# EAGLE schematic PulsGenerator (EAGLE 9.7.0)
COMPANY: ADAFRUIT INDUSTRIES; DRAWN: KTOWN; REV: B
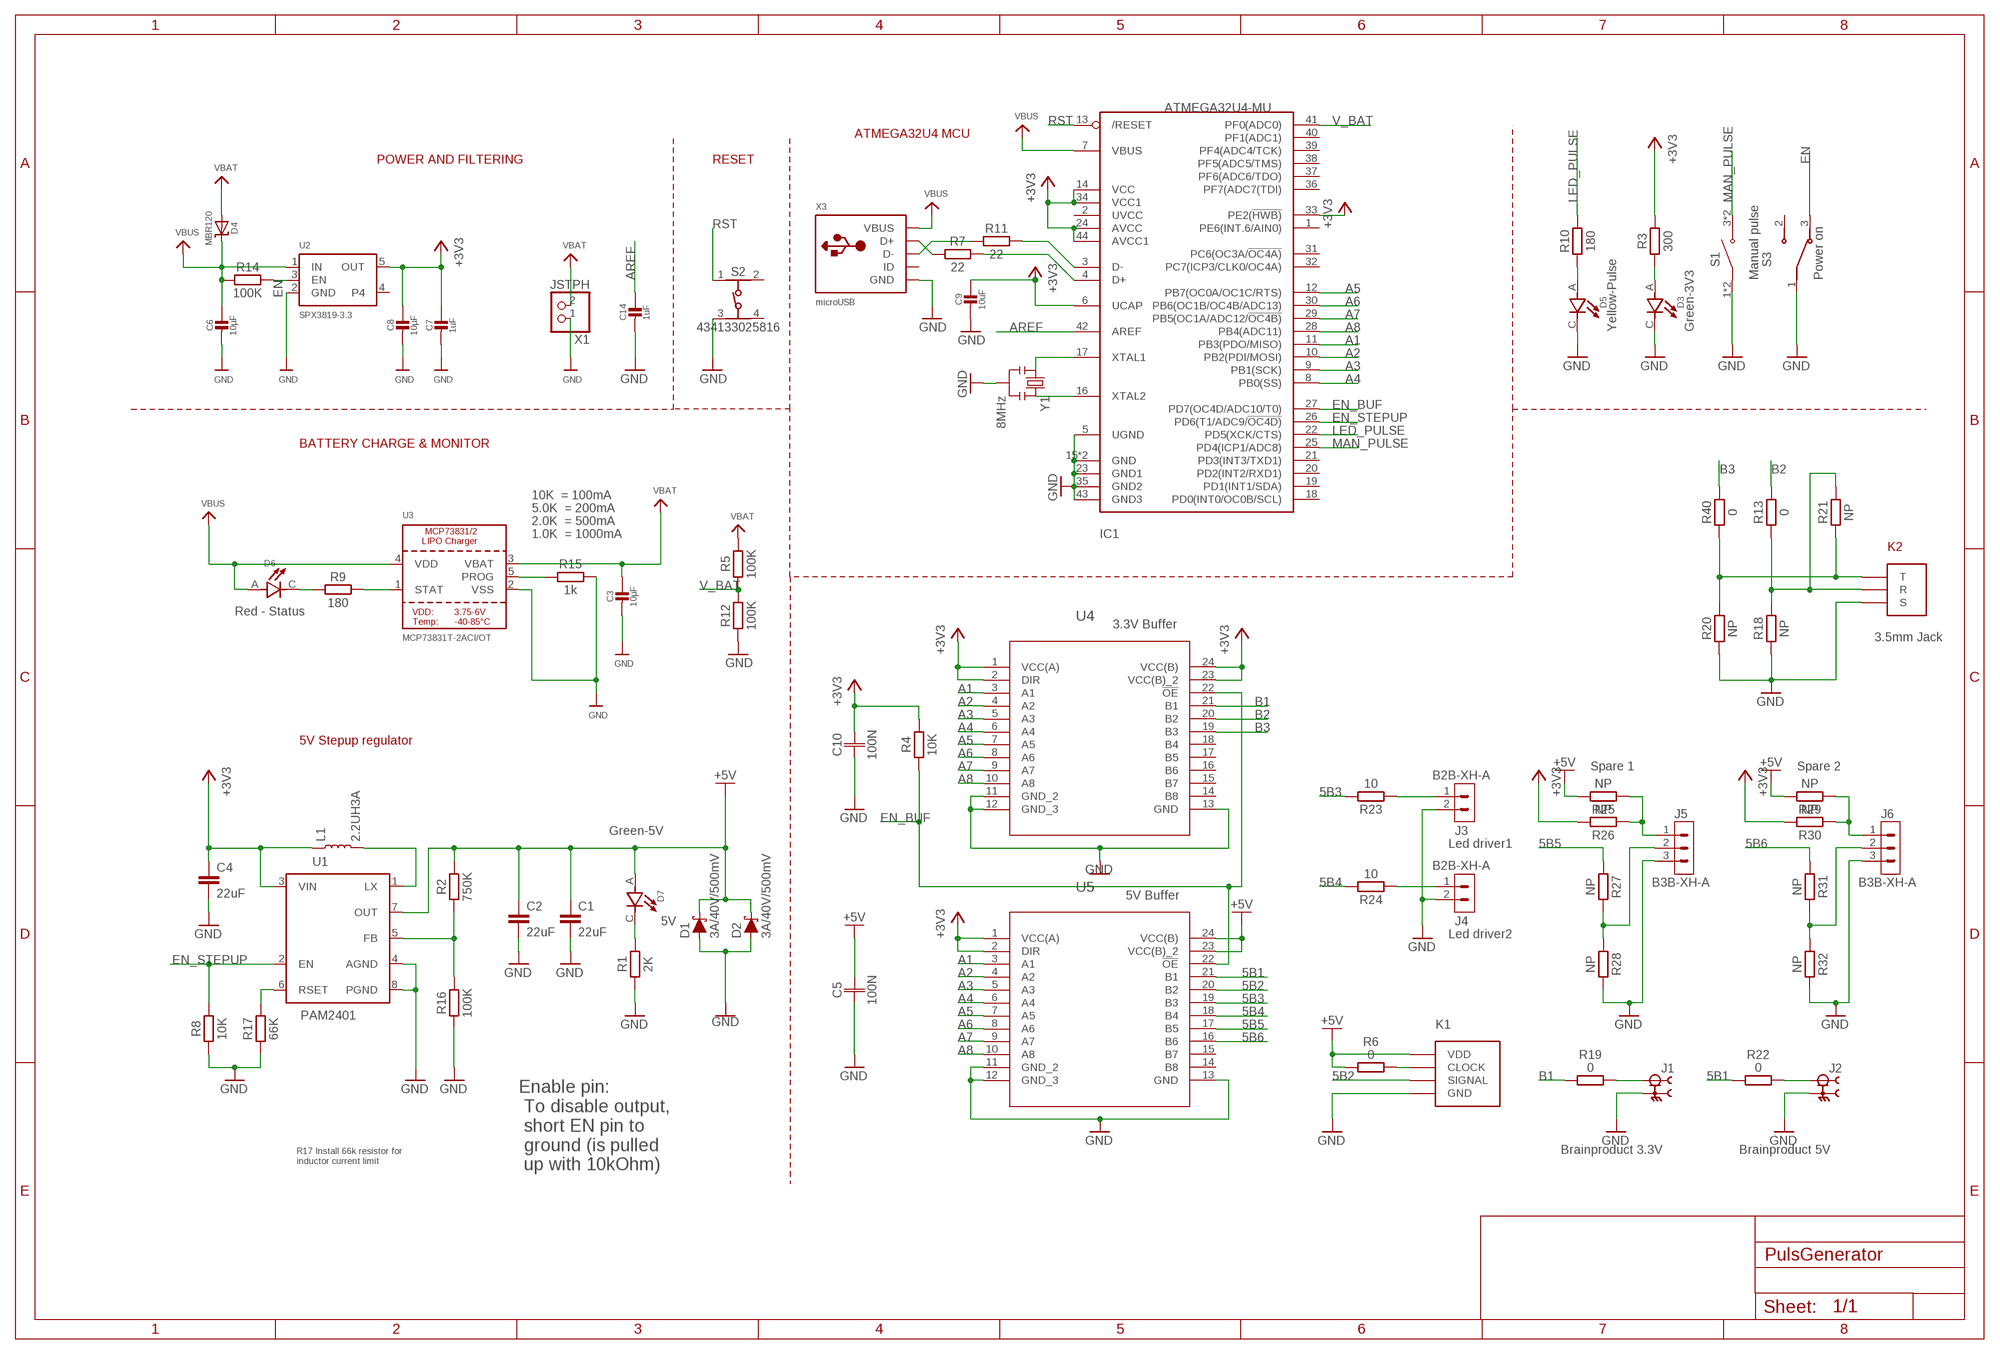
[diagram p0: schematic, sheet 1]

## Parts
C1  22uF  22UF-0805-6.3V-20%  [0805]
C2  22uF  22UF-0805-6.3V-20%  [0805]
C3  10µF  CAP_CERAMIC0805-NOOUTLINE  [0805-NO]
C4  22uF  22UF-0805-6.3V-20%  [0805]
C5  100N  C_CHIP-0603(1608-METRIC)  [CAPC1608X85]
C6  10µF  CAP_CERAMIC0805-NOOUTLINE  [0805-NO]
C7  1uF  CAP_CERAMIC0603_NO  [0603-NO]
C8  10µF  CAP_CERAMIC0805-NOOUTLINE  [0805-NO]
C9  10uF  CAP_CERAMIC0805-NOOUTLINE  [0805-NO]
C10  100N  C_CHIP-0603(1608-METRIC)  [CAPC1608X85]
C14  1uF  CAP_CERAMIC0603_NO  [0603-NO]
D1  3A/40V/500mV  DIODE-SCHOTTKY-B340A  [SMA-DIODE]
D2  3A/40V/500mV  DIODE-SCHOTTKY-B340A  [SMA-DIODE]
D3  597-6201-607F  [LED_597-6201-607F]
D4  MBR120  DIODE-SCHOTTKYSOD-123  [SOD-123]
D5  597-6201-607F  [LED_597-6201-607F]
D6  597-6201-607F  [LED_597-6201-607F]
D7  597-6201-607F  [LED_597-6201-607F]
IC1  ATMEGA32U4-MU  [TQFN44_7MM]
J1  Brainproduct 3.3V  CONBNC001  [LINX_CONBNC001]
J2  Brainproduct 5V  CONBNC001  [LINX_CONBNC001]
J3  B2B-XH-A  [B2B-XH-A]
J4  B2B-XH-A  [B2B-XH-A]
J5  B3B-XH-A  [B3B-XH-A]
J6  B3B-XH-A  [B3B-XH-A]
K1  HR10A-7R-4P  [HR10A-7R-4P]
K2  MJ-073H  [MJ-073H]
L1  2.2UH3A  INDUCTOR-IFSC1515AHER2R2M01  [INDUCTOR_4X4MM]
R1  2K  R_CHIP-0603(1608-METRIC)  [RESC1608X60]
R2  750K  R_CHIP-0603(1608-METRIC)  [RESC1608X60]
R3  300  R_CHIP-0603(1608-METRIC)  [RESC1608X60]
R4  10K  R_CHIP-0603(1608-METRIC)  [RESC1608X60]
R5  100K  R_CHIP-0603(1608-METRIC)  [RESC1608X60]
R6  0  R_CHIP-0603(1608-METRIC)  [RESC1608X60]
R7  22  R_CHIP-0603(1608-METRIC)  [RESC1608X60]
R8  10K  R_CHIP-0603(1608-METRIC)  [RESC1608X60]
R9  180  R_CHIP-0603(1608-METRIC)  [RESC1608X60]
R10  180  R_CHIP-0603(1608-METRIC)  [RESC1608X60]
R11  22  R_CHIP-0603(1608-METRIC)  [RESC1608X60]
R12  100K  R_CHIP-0603(1608-METRIC)  [RESC1608X60]
R13  0  R_CHIP-0603(1608-METRIC)  [RESC1608X60]
R14  100K  R_CHIP-0603(1608-METRIC)  [RESC1608X60]
R15  1k  R_CHIP-0603(1608-METRIC)  [RESC1608X60]
R16  100K  R_CHIP-0603(1608-METRIC)  [RESC1608X60]
R17  66K  R_CHIP-0603(1608-METRIC)  [RESC1608X60]
R18  NP  R_CHIP-0603(1608-METRIC)  [RESC1608X60]
R19  0  R_CHIP-0603(1608-METRIC)  [RESC1608X60]
R20  NP  R_CHIP-0603(1608-METRIC)  [RESC1608X60]
R21  NP  R_CHIP-0603(1608-METRIC)  [RESC1608X60]
R22  0  R_CHIP-0603(1608-METRIC)  [RESC1608X60]
R23  10  R_CHIP-0603(1608-METRIC)  [RESC1608X60]
R24  10  R_CHIP-0603(1608-METRIC)  [RESC1608X60]
R25  NP  R_CHIP-0603(1608-METRIC)  [RESC1608X60]
R26  NP  R_CHIP-0603(1608-METRIC)  [RESC1608X60]
R27  NP  R_CHIP-0603(1608-METRIC)  [RESC1608X60]
R28  NP  R_CHIP-0603(1608-METRIC)  [RESC1608X60]
R29  NP  R_CHIP-0603(1608-METRIC)  [RESC1608X60]
R30  NP  R_CHIP-0603(1608-METRIC)  [RESC1608X60]
R31  NP  R_CHIP-0603(1608-METRIC)  [RESC1608X60]
R32  NP  R_CHIP-0603(1608-METRIC)  [RESC1608X60]
R40  0  R_CHIP-0603(1608-METRIC)  [RESC1608X60]
S1  B3F-1022  [SW_B3F-1022]
S2  434133025816  [434133025816]
S3  MSS-102568-14A-90-D  [SW_MSS-102568-14A-90-D]
U1  PAM2401  [MSOP8]
U2  SPX3819-3.3  VREG_SOT23-5  [SOT23-5]
U3  MCP73831T-2ACI/OT  MCP73831/2  [SOT23-5]
U4  74LVCH8T245PW-Q10JTSSOP24_SOT355-1_NEX  [TSSOP24_SOT355-1_NEX]
U5  74LVCH8T245PW-Q10JTSSOP24_SOT355-1_NEX  [TSSOP24_SOT355-1_NEX]
X1  JSTPH  CON_JST_PH_2PIN  [JSTPH2]
X3  microUSB  USB_MICRO_20329_V2  [4UCONN_20329_V2]
Y1  8MHz  RESONATORSMD  [RESONATOR-SMD]

## Nets
5B1: R22.2 U5.21(B1)
5B2: K1.P$4(SIGNAL) U5.20(B2)
5B3: R23.2 U5.19(B3)
5B4: R24.2 U5.18(B4)
5B5: R27.1 U5.17(B5)
5B6: R31.1 U5.16(B6)
+3V3 [Vcc3V3]: C4.1 C7.1 C8.1 C9.1 C10.2 IC1.6(UCAP) IC1.14(VCC) IC1.24(AVCC) IC1.33(PE2(!HWB)) IC1.34(VCC1) IC1.44(AVCC1) L1.P$1 R3.2 R4.2 R26.2 R30.2 U1.3(VIN) U2.5(OUT) U4.1(VCC(A)) U4.2(DIR) U4.23(VCC(B)_2) U4.24(VCC(B)) U5.1(VCC(A)) U5.2(DIR)
+5V: C1.1 C2.1 C5.2 D1.C D2.C D7.A K1.P$1(VDD) R2.2 R6.2 R25.2 R29.2 U1.7(OUT) U5.23(VCC(B)_2) U5.24(VCC(B))
A1: IC1.11(PB3(PDO/MISO)) U4.3(A1) U5.3(A1)
A2: IC1.10(PB2(PDI/MOSI)) U4.4(A2) U5.4(A2)
A3: IC1.9(PB1(SCK)) U4.5(A3) U5.5(A3)
A4: IC1.8(PB0(SS)) U4.6(A4) U5.6(A4)
A5: IC1.12(PB7(OC0A/OC1C/RTS)) U4.7(A5) U5.7(A5)
A6: IC1.30(PB6(OC1B/OC4B/ADC13)) U4.8(A6) U5.8(A6)
A7: IC1.29(PB5(OC1A/ADC12/!OC4B)) U4.9(A7) U5.9(A7)
A8: IC1.28(PB4(ADC11)) U4.10(A8) U5.10(A8)
AREF: C14.1 IC1.42(AREF)
B1: R19.2 U4.21(B1)
B2: R13.2 U4.20(B2)
B3: R40.2 U4.19(B3)
D+: IC1.4(D+) R7.2
D-: IC1.3(D-) R11.2
EN: R14.2 S3.3 U2.3(EN)
EN_BUF: IC1.27(PD7(OC4D/ADC10/T0)) R4.1 U4.22(!OE) U5.22(!OE)
EN_STEPUP: IC1.26(PD6(T1/ADC9/!OC4D)) R8.2 U1.2(EN)
GND: C1.2 C2.2 C3.2 C4.2 C5.1 C6.2 C7.2 C8.2 C9.2 C10.1 C14.2 D1.A D2.A D3.C D5.C IC1.5(UGND) IC1.15(GND) IC1.23(GND1) IC1.35(GND2) IC1.43(GND3) IC1.THERMAL(GND) J1.S1 J1.S2 J1.S3 J1.S4 J2.S1 J2.S2 J2.S3 J2.S4 J3.2 J4.2 J5.3 J6.3 K1.P$2(GND) K2.P$2(S) R1.1 R8.1 R12.1 R15.2 R16.1 R17.1 R18.1 R20.1 R28.2 R32.2 S1.1(COM) S1.2(COM) S2.3 S3.1 U1.4(AGND) U1.8(PGND) U2.2(GND) U3.2(VSS) U4.11(GND_2) U4.12(GND_3) U4.13(GND) U5.11(GND_2) U5.12(GND_3) U5.13(GND) X1.1 X3.BASE@1(GND) X3.BASE@2(GND) X3.GND X3.SPRT@1(GND) X3.SPRT@2(GND) X3.SPRT@3(GND) X3.SPRT@4(GND) Y1.2
LED_PULSE: IC1.22(PD5(XCK/CTS)) R10.2
MAN_PULSE: IC1.25(PD4(ICP1/ADC8)) S1.3(NO) S1.4(NO)
N$1: D6.C R9.1
N$2: D5.A R10.1
N$3: R9.2 U3.1(STAT)
N$4: R15.1 U3.5(PROG)
N$5: D3.A R3.1
N$7: J1.1 R19.1
N$8: K1.P$3(CLOCK) R6.1
N$9: K2.P$3(T) R20.2 R21.1 R40.1
N$10: K2.P$1(R) R13.1 R18.2 R21.2
N$11: IC1.16(XTAL2) Y1.3
N$12: IC1.17(XTAL1) Y1.1
N$14: J2.1 R22.1
N$15: R7.1 X3.D+
N$16: R11.1 X3.D-
N$17: J3.1 R23.1
N$18: J4.1 R24.1
N$19: J5.1 R25.1 R26.1
N$20: J6.1 R29.1 R30.1
N$21: J5.2 R27.2 R28.1
N$22: J6.2 R31.2 R32.1
N$49: R2.1 R16.2 U1.5(FB)
N$50: L1.P$2 U1.1(LX)
N$51: R17.2 U1.6(RSET)
N$52: D7.C R1.2
RST: IC1.13(/RESET) S2.1
V_BAT: IC1.41(PF0(ADC0)) R5.1 R12.2
VBAT [Vbat]: C3.1 D4.A R5.2 U3.3(VBAT) X1.2
VBUS [Vbus]: C6.1 D4.C D6.A IC1.7(VBUS) R14.1 U2.1(IN) U3.4(VDD) X3.VBUS
Unconnected: IC1.1(PE6(INT.6/AIN0)) IC1.2(UVCC) IC1.18(PD0(INT0/OC0B/SCL)) IC1.19(PD1(INT1/SDA)) IC1.20(PD2(INT2/RXD1)) IC1.21(PD3(INT3/TXD1)) IC1.31(PC6(OC3A/!OC4A)) IC1.32(PC7(ICP3/CLK0/OC4A)) IC1.36(PF7(ADC7(TDI)) IC1.37(PF6(ADC6/TDO)) IC1.38(PF5(ADC5/TMS)) IC1.39(PF4(ADC4/TCK)) IC1.40(PF1(ADC1)) S2.2 S2.4 S3.2 U2.4 U4.14(B8) U4.15(B7) U4.16(B6) U4.17(B5) U4.18(B4) U5.14(B8) U5.15(B7) X3.ID

## Notes on the sheet
- ATMEGA32U4 MCU
- POWER AND FILTERING | RESET
- Manual pulse | Power on
- Yellow-Pulse | Green-3V3
- BATTERY CHARGE & MONITOR
- 10K  = 100mA
- 5.0K  = 200mA
- 2.0K  = 500mA
- 1.0K  = 1000mA
- Red - Status
- 3.3V Buffer
- 3.5mm Jack
- 5V Stepup regulator
- Spare 1 | Spare 2
- Green-5V
- Led driver1
- 5V Buffer
- 5V
- Led driver2
- Enable pin:
   To disable output,
   short EN pin to
   ground (is pulled
   up with 10kOhm)
- R17 Install 66k resistor for
  inductor current limit

## Library data of the parts
C1 C2 C4 = SparkFun-Capacitors:22UF: 22µF ceramic capacitors A capacitor is a passive two-terminal electrical component used to store electrical energy temporarily in an electric field.; FARNELL: 1867956
C3 C9 C14 = PulsGenerator v26:CAP_CERAMIC: Ceramic Capacitors For new designs, use the packages preceded by an '_' character since they are more reliable: The following footprints should be used on most boards: _0402 - Standard footprint for regular board layouts _0603 - Standard footprint for regular board layouts _0805 - Standard footprint for regular board layouts _1206 - Standard footprint for regular board layouts For extremely tight-pitch boards where space is at a premium, the following 'micro-pitch' footprints can be used (smaller pads, no silkscreen outline, etc.): _0402MP - Micro-pitch footprint for very dense/compact boards _0603MP - Micro-pitch footprint for very dense/compact boards _0805MP - Micro-pitch footprint for very dense/compact boards _1206MP - Micro-pitch footprint for very dense/compact boards
C5 C10 = Capacitor:C: Capacitor - Generic
C6 C8 = PulsGenerator v26:CAP_CERAMIC: Ceramic Capacitors For new designs, use the packages preceded by an '_' character since they are more reliable: The following footprints should be used on most boards: _0402 - Standard footprint for regular board layouts _0603 - Standard footprint for regular board layouts _0805 - Standard footprint for regular board layouts _1206 - Standard footprint for regular board layouts For extremely tight-pitch boards where space is at a premium, the following 'micro-pitch' footprints can be used (smaller pads, no silkscreen outline, etc.): _0402MP - Micro-pitch footprint for very dense/compact boards _0603MP - Micro-pitch footprint for very dense/compact boards _0805MP - Micro-pitch footprint for very dense/compact boards _1206MP - Micro-pitch footprint for very dense/compact boards; FARNELL: 3924598
C7 = PulsGenerator v26:CAP_CERAMIC: Ceramic Capacitors For new designs, use the packages preceded by an '_' character since they are more reliable: The following footprints should be used on most boards: _0402 - Standard footprint for regular board layouts _0603 - Standard footprint for regular board layouts _0805 - Standard footprint for regular board layouts _1206 - Standard footprint for regular board layouts For extremely tight-pitch boards where space is at a premium, the following 'micro-pitch' footprints can be used (smaller pads, no silkscreen outline, etc.): _0402MP - Micro-pitch footprint for very dense/compact boards _0603MP - Micro-pitch footprint for very dense/compact boards _0805MP - Micro-pitch footprint for very dense/compact boards _1206MP - Micro-pitch footprint for very dense/compact boards; FARNELL: 2464627
D1 D2 = SparkFun-DiscreteSemi:DIODE-SCHOTTKY: Schottky diode A Schottky diode is a semiconductor diode which has a low forward voltage drop and a very fast switching action.; FARNELL: 1843668
D3 D7 = ESP32-S3-WROOM-1-N16R8:597-6201-607F; FARNELL: 3548407
D4 = PulsGenerator v26:DIODE-SCHOTTKY; FARNELL: 2533227
D5 = ESP32-S3-WROOM-1-N16R8:597-6201-607F; FARNELL: 3548408
D6 = ESP32-S3-WROOM-1-N16R8:597-6201-607F; FARNELL: 1760712
IC1 = PulsGenerator v26:ATMEGA32U4: http://www.ladyada.net/library/eagle
J1 J2 = ESP32-S3-WROOM-1-N16R8:CONBNC001: Check availability <https://pricing.snapeda.com/parts/CONBNC001/Linx%20Technologies%20Inc./view-part?ref=eda>; FARNELL: 4734474
J3 J4 = Connector:B2B-XH-A: XH Connector Top Entry - 2POS Reference: : Datasheet <http://www.jst-mfg.com/product/pdf/eng/eXH.pdf>; FARNELL: 1516276
J5 J6 = Connector:B3B-XH-A: XH Connector Top Entry - 3POS Reference: Datasheet <http://www.jst-mfg.com/product/pdf/eng/eXH.pdf>; FARNELL: 1516277
K1 = Hirose:HR10A-7R-4P; FARNELL: 1826972
K2 = MJ-073H:MJ-073H; FARNELL: 1267396
L1 = SparkFun-Coils:INDUCTOR: Inductors Resist changes in electrical current. Basically a coil of wire. SparkFun Products: SparkFun Load Cell Amplifier - HX711 <https://www.sparkfun.com/products/13879> IOIO-OTG - V2.2 <https://www.sparkfun.com/products/13613>; FARNELL: 2352690
R1-R32 R40 = Resistor:R: Resistor Fixed - Generic
S1 = ESP32-S3-WROOM-1-N16R8:B3F-1022; FARNELL: 1829495
S2 = Wurth_Switch_WS-TASV:434133025816: WS-TASV J-Bend SMT Tact Switch 4.2x3.2 mm MATERIAL PROPERTIES Cover Material Stainless Steel PROPERTIES Actuator Material LCP Actuator Flammability Rating UL94 V-0 Actuator Color Black; White Frame Material LCP Frame Flammability Rating UL94 V-0 Frame Color Black Contact Material Stainless Steel Contact Plating Silver Terminal Material Copper Alloy Terminal Plating Silver VR 16 V (DC) Contact Resistance Initial 500 mΩ Contact Resistance After Life Test 1 Ω RISO 100 MΩ Withstanding Voltage 250 V (AC) Qty. 2900 Mechanical Properties Stroke 0.2 mm GENERAL INFORMATION Operating Temperature -40 up to +85 °C PACKAGING PROPERTIES Packaging Tape and Reel <https://www.we-online.com/catalog/media/o106805v209%20Family_WS-TASV-4341x30258x6_Gruppe.jpg> Details see: https://www.we-online.com/catalog/en/TASV_4_2X3_2_SMD_J-BEND/ Created by Yingchun,Shan 2020-02-20 2020(C) Wurth Elektronik; FARNELL: 3806211
S3 = ESP32-S3-WROOM-1-N16R8:MSS-102568-14A-90-D; FARNELL: 4814103
U1 = SparkFun-IC-Power:PAM2401: PAM2401 - Boost PMIC Specifications: Up to 1A output current 0.9V to 4.75V Input Range 2.5V to 5.0V Adjustable Output Voltage Datasheet <https://www.diodes.com/assets/Datasheets/PAM2401.pdf> (Diodes inc.); FARNELL: 3483107
U2 = PulsGenerator v26:VREG_SOT23-5: SOT23-5 Fixed Voltage Regulators Part Current Out V Out V In V Dropout θJA (°C/W) TJ (°C) Digikey Part No. ADP121 150mA 3.3V 3.4-5.5V 0.09V @ 150mA -- -- ADP121-AUJZ33R7CT-ND ADP121 150mA 3.0V 3.1-5.5V 0.09V @ 150mA -- -- ADP121-AUJZ30R7CT-ND ADP122 300mA 3.3V 3.4-5.5V 0.085V @ 300mA -- -- ADP122AUJZ-3.3-R7CT-ND ADP1712 300mA 3.3V 3.5-5.5V 0.17V @ 300mA -- -- ADP1712AUJZ-3.3-R7TR-ND AP7311 (Low Cost) 150mA 3.3V 3.5-6V 0.15V @ 150mA -- -- AP7311-33WG-7DICT-ND LD39015M18R 150mA 1.8V 1.9V-5.5V 0.08V @ 100mA -- -- 497-6977-1-ND LP2985A-33DBVR 150mA 3.3V 3.3-16V 0.28V @ 150mA 206 150 296-18479-1-ND MCP1824T-3302E/OT 300mA 3.3V 3.5V-6V 0.2V @ 300mA -- -- MCP1824T-3302E/OTCT-ND MIC5205-2.5YM5 TR 150mA 2.5V 2.7-16V 0.165V @ 150mA -- -- 576-1257-2-ND MIC5205-3.0YM5 TR 150mA 3.0V 3.2V-16V 0.165V @ 150mA -- -- 576-1258-2-ND MIC5205-3.3YM5 TR 150mA 3.3V 3.5V-16V 0.165V @ 150mA -- -- 576-1259-2-ND TPS780330220 150mA 3.3V+2.2V 3.6-5.5V 250mV Max -- -- 296-23332-1-ND TDA3663/N1,135 100mA 3.3V 3.5-45V 0.18V @ 50mA -- -- 568-5343-1-ND Max operating temp can be calculated using θJA, TJ (max junction temperature), and power in watts. Set the "Maximum Ambient Temperature" until it reaches TJ ("Max Junction Temperature"), which is the absolute limit for safe use of the regulator: Heat Sink Temperature Calculator <http://www.daycounter.com/Calculators/Heat-Sink-Temperature-Calculator.phtml> For example, With 12V source into a 3.3V LP2985 and a 30mA load, we are dissipating (12V-3.3V) * 0.03A = 0.261W. With a θJA of 206 °C/W, a TJ of 150°C, and 261mW we can safely use the chip without a heat sink up to 75°C (=147.1°C Junction Temperature).
U3 = PulsGenerator v26:MCP73831/2: MCP73831/2 LIPO Charger VDD: 3.75 - 6V Temp -40 - 85°C Programmable Charge Rate: 15-500mA NOTE: STAT is a tri-state logic output on the MCP73831 and an open-drain output on the MCP73832. SOT23-5 with 4.2V output and tri-state logic on STAT = MCP73831T-2ACI/OT; FARNELL: 1332158
U4 U5 = 74LVCH8T245:74LVCH8T245PW-Q10J; FARNELL: 2444918
X1 = PulsGenerator v26:CON_JST_PH_2PIN: JST 2-Pin Right-Angle Connector PH-Series - 4UConnector: 17311 SH-Series - 4UConnector: 07278
X3 = PulsGenerator v26:USB: USB Connectors USBMINIB - Surface Mount Female Mini-B USB Connector 4UConnector: 06564
Y1 = SparkFun:RESONATOR: Resonator Small SMD resonator. This is the itty bitty 10/20MHz resonators with built in caps. CSTCE10M0G55 and CSTCE20M0V53. Footprint has been reviewed closely but hasn't been tested yet.

## Net classes
0 default: width 0.203 mm
1 Vbus: width 0.203 mm
2 Vbat: width 0.203 mm
3 Vcc3V3: width 0.203 mm